# Altium schematic sheet Arriquitaun.SchDoc
size A3
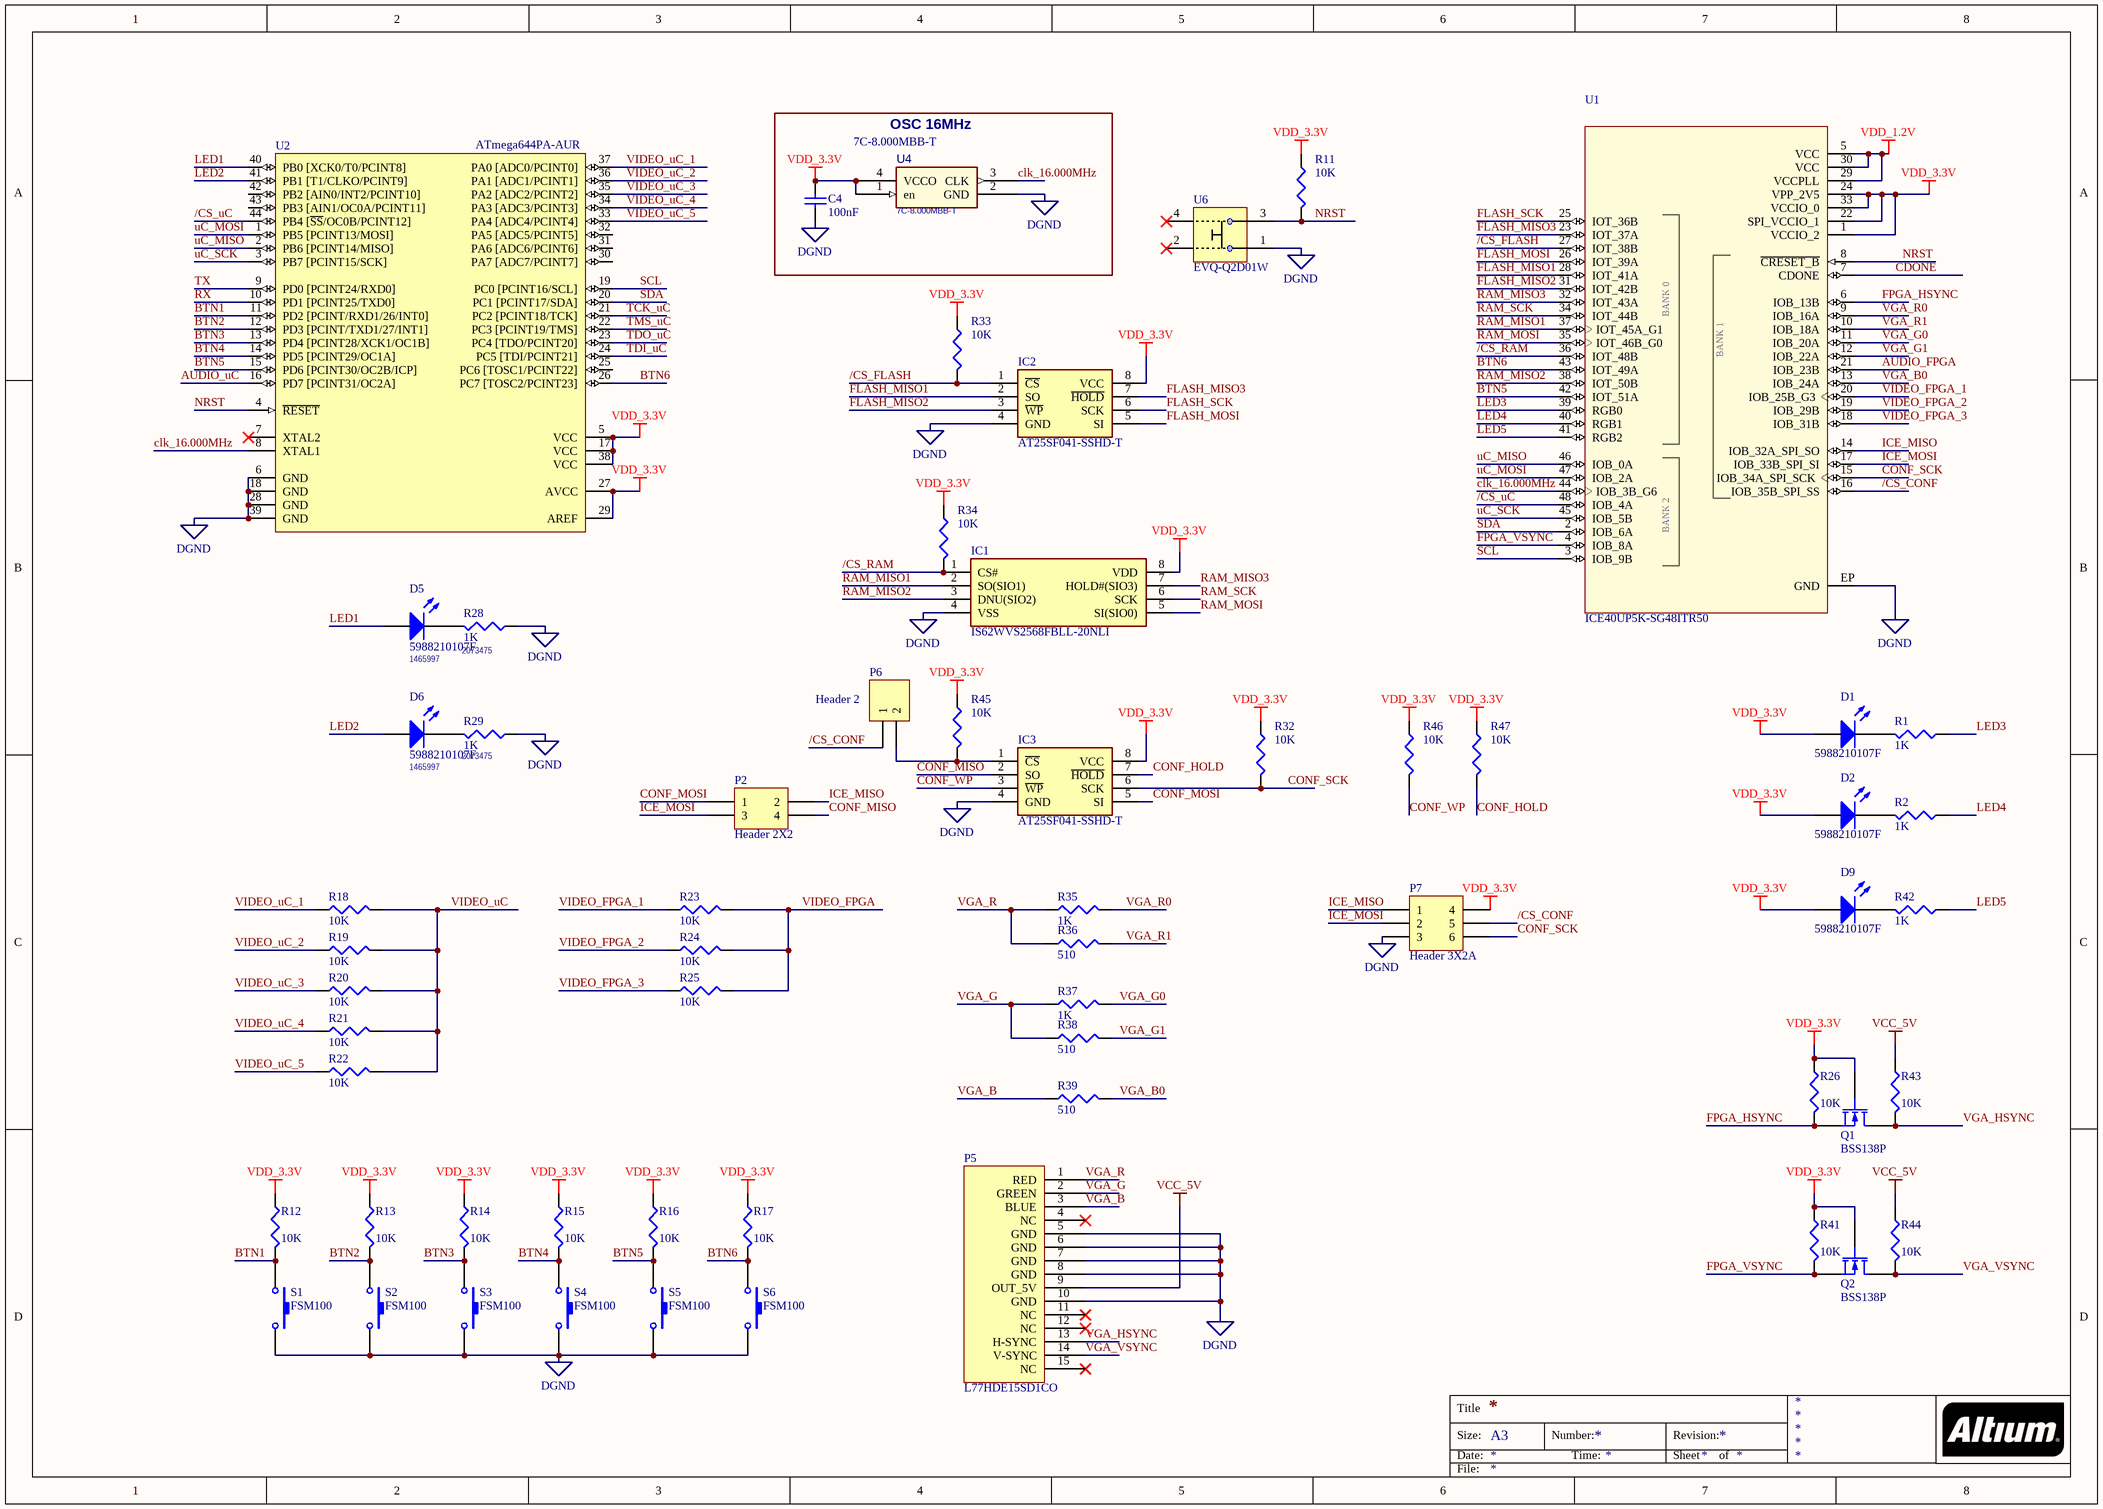
[diagram p0: Arriquitaun.SchDoc]

## Parts
C4  value 100nF  [C1206]  (hidden comment: Cap Semi)
D1  5988210107F  [1206 - LED]
D2  5988210107F  [1206 - LED]
D5  5988210107F  Supplier Part Number 1: 1465997  [1206 - LED]
D6  5988210107F  Supplier Part Number 1: 1465997  [1206 - LED]
D9  5988210107F  [1206 - LED]
IC1  IS62WVS2568FBLL-20NLI  [SOIC127P600X175-8N]
IC2  AT25SF041-SSHD-T  [SOIC127P600X175-8N]
IC3  AT25SF041-SSHD-T  [SOIC127P600X175-8N]
P2  Header 2X2  [HDR2X2]
P5  L77HDE15SD1CO  [DVI-15]
P6  Header 2  [HDR1X2]
P7  Header 3X2A  [HDR2X3_CEN]
Q1  BSS138P  [*SOT23-W]
Q2  BSS138P  [*SOT23-W]
R1  value 1K  [c1206]  (hidden comment: Res3)
R2  value 1K  [c1206]  (hidden comment: Res3)
R11  value 10K  [c1206]  (hidden comment: Res3)
R12  value 10K  [c1206]  (hidden comment: Res3)
R13  value 10K  [c1206]  (hidden comment: Res3)
R14  value 10K  [c1206]  (hidden comment: Res3)
R15  value 10K  [c1206]  (hidden comment: Res3)
R16  value 10K  [c1206]  (hidden comment: Res3)
R17  value 10K  [c1206]  (hidden comment: Res3)
R18  value 10K  [c1206]  (hidden comment: Res3)
R19  value 10K  [c1206]  (hidden comment: Res3)
R20  value 10K  [c1206]  (hidden comment: Res3)
R21  value 10K  [c1206]  (hidden comment: Res3)
R22  value 10K  [c1206]  (hidden comment: Res3)
R23  value 10K  [c1206]  (hidden comment: Res3)
R24  value 10K  [c1206]  (hidden comment: Res3)
R25  value 10K  [c1206]  (hidden comment: Res3)
R26  value 10K  [c1206]  (hidden comment: Res3)
R28  value 1K  Supplier Part Number 1: 2073475  [c1206]  (hidden comment: Res3)
R29  value 1K  Supplier Part Number 1: 2073475  [c1206]  (hidden comment: Res3)
R32  value 10K  [c1206]  (hidden comment: Res3)
R33  value 10K  [c1206]  (hidden comment: Res3)
R34  value 10K  [c1206]  (hidden comment: Res3)
R35  value 1K  [c1206]  (hidden comment: Res3)
R36  value 510  [c1206]  (hidden comment: Res3)
R37  value 1K  [c1206]  (hidden comment: Res3)
R38  value 510  [c1206]  (hidden comment: Res3)
R39  value 510  [c1206]  (hidden comment: Res3)
R41  value 10K  [c1206]  (hidden comment: Res3)
R42  value 1K  [c1206]  (hidden comment: Res3)
R43  value 10K  [c1206]  (hidden comment: Res3)
R44  value 10K  [c1206]  (hidden comment: Res3)
R45  value 10K  [c1206]  (hidden comment: Res3)
R46  value 10K  [c1206]  (hidden comment: Res3)
R47  value 10K  [c1206]  (hidden comment: Res3)
S1  FSM100  [FSM100]
S2  FSM100  [FSM100]
S3  FSM100  [FSM100]
S4  FSM100  [FSM100]
S5  FSM100  [FSM100]
S6  FSM100  [FSM100]
U1  ICE40UP5K-SG48ITR50  [*QFN50P700X700X100-49N_ICE40UP5K-SG48ITR50(Primary)]
U2  ATmega644PA-AUR  [44A_N]
U4  7C-8.000MBB-T  [OSCILADOR]
U6  EVQ-Q2D01W  [PUSHBUTTON]

## Blocks framed on the sheet
OSC 16MHz: C4 U4

## Nets
DGND: C4.1 IC1.4(VSS) IC2.4(GND) IC3.4(GND) P5.5(GND) P5.6(GND) P5.7(GND) P5.8(GND) P5.10(GND) P7.3 R28.1 R29.1 S1.2 S2.2 S3.2 S4.2 S5.2 S6.2 U1.EP(GND) U2.6(GND) U2.18(GND) U2.28(GND) U2.39(GND) U4.2(GND) U6.1
VCC_5V: P5.9(OUT_5V) R43.1 R44.1
VDD_1.2V: U1.5(VCC) U1.29(VCCPLL) U1.30(VCC)
VDD_3.3V: C4.2 D1.1(A) D2.1(A) D9.1(A) IC1.8(VDD) IC2.8(VCC) IC3.8(VCC) P7.4 Q1.1(G) Q2.1(G) R11.1 R12.1 R13.1 R14.1 R15.1 R16.1 R17.1 R26.1 R32.1 R33.1 R34.1 R41.1 R45.1 R46.1 R47.1 U1.1(VCCIO_2) U1.22(SPI_VCCIO_1) U1.24(VPP_2V5) U1.33(VCCIO_0) U2.5(VCC) U2.17(VCC) U2.27(AVCC) U2.29(AREF) U2.38(VCC) U4.1(en) U4.4(VCCO)
/CS_CONF: P6.1 P7.5 U1.16(IOB_35B_SPI_SS)
/CS_FLASH: IC2.1(~{CS}) R33.2 U1.27(IOT_38B)
/CS_RAM: IC1.1(CS#) R34.2 U1.36(IOT_48B)
/CS_uC: U1.48(IOB_4A) U2.44(PB4_[~{SS}/OC0B/PCINT12])
AUDIO_FPGA: U1.21(IOB_23B)
AUDIO_uC: U2.16(PD7_[PCINT31/OC2A])
BTN1: R12.2 S1.1 U2.11(PD2_[PCINT/RXD1/26/INT0])
BTN2: R13.2 S2.1 U2.12(PD3_[PCINT/TXD1/27/INT1])
BTN3: R14.2 S3.1 U2.13(PD4_[PCINT28/XCK1/OC1B])
BTN4: R15.2 S4.1 U2.14(PD5_[PCINT29/OC1A])
BTN5: R16.2 S5.1 U1.42(IOT_51A) U2.15(PD6_[PCINT30/OC2B/ICP])
BTN6: R17.2 S6.1 U1.43(IOT_49A) U2.26(PC7_[TOSC2/PCINT23])
CDONE: U1.7(CDONE)
clk_16.000MHz: U1.44(IOB_3B_G6) U2.8(XTAL1) U4.3(CLK)
CONF_HOLD: IC3.7(~{HOLD}) R47.2
CONF_MISO: IC3.2(SO) P2.4
CONF_MOSI: IC3.5(SI) P2.1
CONF_SCK: IC3.6(SCK) P7.6 R32.2 U1.15(IOB_34A_SPI_SCK)
CONF_WP: IC3.3(~{WP}) R46.2
FLASH_MISO1: IC2.2(SO) U1.28(IOT_41A)
FLASH_MISO2: IC2.3(~{WP}) U1.31(IOT_42B)
FLASH_MISO3: IC2.7(~{HOLD}) U1.23(IOT_37A)
FLASH_MOSI: IC2.5(SI) U1.26(IOT_39A)
FLASH_SCK: IC2.6(SCK) U1.25(IOT_36B)
FPGA_HSYNC: Q1.2(S) R26.2 U1.6(IOB_13B)
FPGA_VSYNC: Q2.2(S) R41.2 U1.4(IOB_8A)
ICE_MISO: P2.2 P7.1 U1.14(IOB_32A_SPI_SO)
ICE_MOSI: P2.3 P7.2 U1.17(IOB_33B_SPI_SI)
LED1: D5.1(A) U2.40(PB0_[XCK0/T0/PCINT8])
LED2: D6.1(A) U2.41(PB1_[T1/CLKO/PCINT9])
LED3: R1.1 U1.39(RGB0)
LED4: R2.1 U1.40(RGB1)
LED5: R42.1 U1.41(RGB2)
NRST: R11.2 U1.8(~{CRESET_B}) U2.4(~{RESET}) U6.3
RAM_MISO1: IC1.2(SO(SIO1)) U1.37(IOT_45A_G1)
RAM_MISO2: IC1.3(DNU(SIO2)) U1.38(IOT_50B)
RAM_MISO3: IC1.7(HOLD#(SIO3)) U1.32(IOT_43A)
RAM_MOSI: IC1.5(SI(SIO0)) U1.35(IOT_46B_G0)
RAM_SCK: IC1.6(SCK) U1.34(IOT_44B)
RX: U2.10(PD1_[PCINT25/TXD0])
SCL: U1.3(IOB_9B) U2.19(PC0_[PCINT16/SCL])
SDA: U1.2(IOB_6A) U2.20(PC1_[PCINT17/SDA])
TCK_uC: U2.21(PC2_[PCINT18/TCK])
TDI_uC: U2.24(PC5_[TDI/PCINT21])
TDO_uC: U2.23(PC4_[TDO/PCINT20])
TMS_uC: U2.22(PC3_[PCINT19/TMS])
TX: U2.9(PD0_[PCINT24/RXD0])
uC_MISO: U1.46(IOB_0A) U2.2(PB6_[PCINT14/MISO])
uC_MOSI: U1.47(IOB_2A) U2.1(PB5_[PCINT13/MOSI])
uC_SCK: U1.45(IOB_5B) U2.3(PB7_[PCINT15/SCK])
VGA_B: P5.3(BLUE) R39.1
VGA_B0: R39.2 U1.13(IOB_24A)
VGA_G: P5.2(GREEN) R37.1 R38.1
VGA_G0: R37.2 U1.11(IOB_20A)
VGA_G1: R38.2 U1.12(IOB_22A)
VGA_HSYNC: P5.13(H-SYNC) Q1.3(D) R43.2
VGA_R: P5.1(RED) R35.1 R36.1
VGA_R0: R35.2 U1.9(IOB_16A)
VGA_R1: R36.2 U1.10(IOB_18A)
VGA_VSYNC: P5.14(V-SYNC) Q2.3(D) R44.2
VIDEO_FPGA: R23.2 R24.2 R25.2
VIDEO_FPGA_1: R23.1 U1.20(IOB_25B_G3)
VIDEO_FPGA_2: R24.1 U1.19(IOB_29B)
VIDEO_FPGA_3: R25.1 U1.18(IOB_31B)
VIDEO_uC: R18.2 R19.2 R20.2 R21.2 R22.2
VIDEO_uC_1: R18.1 U2.37(PA0_[ADC0/PCINT0])
VIDEO_uC_2: R19.1 U2.36(PA1_[ADC1/PCINT1])
VIDEO_uC_3: R20.1 U2.35(PA2_[ADC2/PCINT2])
VIDEO_uC_4: R21.1 U2.34(PA3_[ADC3/PCINT3])
VIDEO_uC_5: R22.1 U2.33(PA4_[ADC4/PCINT4])
NetD1_2: D1.2(K) R1.2
NetD2_2: D2.2(K) R2.2
NetD5_2: D5.2(K) R28.2
NetD6_2: D6.2(K) R29.2
NetD9_2: D9.2(K) R42.2
NetIC3_1: IC3.1(~{CS}) P6.2 R45.2

Not connected (* = marked no-connect by the designer): P5 4(NC)* 11(NC)* 12(NC)* 15(NC)*; U2 7(XTAL2)* 25(PC6_[TOSC1/PCINT22]) 30(PA7_[ADC7/PCINT7]) 31(PA6_[ADC6/PCINT6]) 32(PA5_[ADC5/PCINT5]) 42(PB2_[AIN0/INT2/PCINT10]) 43(PB3_[AIN1/OC0A/PCINT11]); U6 2* 4*

## Notes on the sheet
- Title
- Size:
- Date:
- A3
- Number:
- Time:
- Revision:
- Sheet
- of
- File:
- (in symbol ICE40UP5K-SG48ITR50) BANK 0; BANK 1; BANK 2

## Library data of the parts
C4 = Cap Semi: Capacitor (Semiconductor SIM Model); Published: 8-Jun-2000; LatestRevisionDate: 29-May-2009; LatestRevisionNote: IPC-7351 Footprint Added.; PackageReference: C1206; Publisher: Altium Limited; PackageDescription: Chip Capacitor; Supplier 1: Farnell; Supplier part number 1: 1759123
D1 D2 D5 D6 D9 = 5988210107F: LED, Rojo, Montaje Superficial, 1206 (Métrico 3216), 20 mA, 2 V, 640 nm; Published: 8-Jun-2000; LatestRevisionDate: 17-Jul-2002; LatestRevisionNote: Re-released for DXP Platform.; PackageVersion: Feb-2002; PackageReference: 3.2X1.6X1.1; Publisher: Altium Limited; PackageDescription: SM LED; 2 Flat Leads; Supplier 1: Farnell; ComponentLink1Description: Mouser; ComponentLink1URL: https://eu.mouser.com/ProductDetail/Dialight/598-8210-107F?qs=sGAEpiMZZMseGfSY3csMkcUUSK%2FIVnSgwPTZO%252Bt9HCE%3D; Supplier 2: Mouser; Supplier Part Number 2: 645-598-8210-107F
  D1 D2 D9: Supplier Part Number 1: 1465997
IC1 = IS62WVS2568FBLL-20NLI: SRAM 2Mb 256Kx8 20MHz 2.2-3.6V Serial SRAM; Manufacturer_Name: Integrated Silicon Solution Inc.; Datasheet Link: http://www.issi.com/WW/pdf/IS62-65WVS2568FALL-BLL.pdf; Height: 1.75mm; Manufacturer_Part_Number: IS62WVS2568FBLL-20NLI; Mouser Part Number: 870-WVS2568FBLL20NLI; Mouser Price/Stock: https://www.mouser.com/Search/Refine.aspx?Keyword=870-WVS2568FBLL20NLI; Supplier 1: Mouser; ComponentLink1Description: Mouser; ComponentLink1URL: https://www.mouser.es/ProductDetail/ISSI/IS62WVS2568FBLL-20NLI?qs=sGAEpiMZZMs6Aik9Fp479pkTONfEyU%252BtPqF9anFQNgY%3D; Supplier Part Number 1: 870-WVS2568FBLL20NLI
IC2 IC3 = AT25SF041-SSHD-T: Flash NOR 4Mb, 2.5-3.6V,104Mhz Serial Flash; Manufacturer_Name: Adesto Technologies; Datasheet Link: https://www.adestotech.com/wp-content/uploads/DS-AT25SF041_044.pdf; Height: 1.75mm; Manufacturer_Part_Number: AT25SF041-SSHD-T; Mouser Part Number: 988-AT25SF041-SSHD-T; Mouser Price/Stock: https://www.mouser.com/Search/Refine.aspx?Keyword=988-AT25SF041-SSHD-T; ComponentLink1Description: Mouser; ComponentLink1URL: https://www.mouser.es/ProductDetail/Adesto-Technologies/AT25SF041-SSHD-T?qs=sGAEpiMZZMtI%252BQ06EiAoG2tRW1ubUobjTmCSnL3k0Dw%3D; Supplier 1: Mouser; Supplier 2: Farnell; Supplier Part Number 1: 988-AT25SF041-SSHD-T; Supplier Part Number 2: 2909988
P2 = Header 2X2: Header, 2-Pin, Dual row; LatestRevisionDate: 17-Jul-2002; LatestRevisionNote: Re-released for DXP Platform.; Publisher: Altium Limited
P5 = L77HDE15SD1CO: D-Sub High Density Connectors D SUB; ComponentLink1Description: Mouser; ComponentLink1URL: https://www.mouser.es/ProductDetail/Amphenol-Commercial-Products/L77HDE15SD1CO?qs=sGAEpiMZZMvlX3nhDDO4AIhmb3wSIX3bv9XlW7v%2F%2FAg=; Supplier 1: Mouser
P6 = Header 2: Header, 2-Pin; LatestRevisionDate: 17-Jul-2002; LatestRevisionNote: Re-released for DXP Platform.; Publisher: Altium Limited
P7 = Header 3X2A: Header, 3-Pin, Dual row; LatestRevisionDate: 17-Jul-2002; LatestRevisionNote: Re-released for DXP Platform.; Publisher: Altium Limited
Q1 Q2 = BSS138P: MOSFET N-CH 60 V 360 mA; ComponentLink1Description: Mouser; ComponentLink1URL: https://www.mouser.es/ProductDetail/Nexperia/BSS138P215?qs=sGAEpiMZZMuW3D0gRv32gn9EhwRhF9cb; Supplier 1: Digi-Key; Supplier 2: Farnell; Supplier 3: Mouser; Supplier Part Number 1: 1727-1142-6-ND; Supplier Part Number 2: 1859849RL; Supplier Part Number 3: 771-BSS138P215
R1 R2 R11-R26 R28 R29 R32-R39 R41-R47 = Res3: Resistor; Published: 8-Jun-2000; LatestRevisionDate: 29-May-2009; LatestRevisionNote: IPC-7351 Footprint Added.; PackageReference: J1-0603; Publisher: Altium Limited; PackageDescription: Chip Resistor
  R1 R2 R42: Supplier 1: Farnell; Supplier Part Number 1: 2073475
  R11 R32-R34 R45-R47: Supplier 1: Farnell; Supplier Part Number 1: 2073356
  R28 R29: Supplier 1: Farnell
S1-S6 = FSM100: Interruptores táctiles 12mm FLSH OFF-(ON); Published: 24-Mar-1999; LatestRevisionDate: 17-Jul-2002; LatestRevisionNote: Re-released for DXP Platform.; PackageReference: SPST-2; Publisher: Altium Limited; PackageDescription: Switch; 2 Leads; Supplier 1: Mouser; Supplier Part Number 1: 506-FSM100; Supplier 2: Farnell; Supplier Part Number 2: 1570388
U1 = ICE40UP5K-SG48ITR50: iCE40 UltraPlus 5280 LUTs 39 I/O 1.2 V Surface Mount FOPGA - QFN-48; MF: Lattice Semiconductor; SnapEDA_Link: https://www.snapeda.com/parts/ICE40UP5K-SG48ITR50/Lattice%20Semiconductor%20Corporation/view-part/?ref=snap; Package: QFN-48 Lattice Semiconductor; Availability: Unavailable; Price: None; MP: ICE40UP5K-SG48ITR50; Value: *; Supplier 1: Mouser; Supplier Part Number 1: 842-E40UP5KSG48ITR50; Supplier 2: Digi-Key; Supplier Part Number 2: 220-2145-6-ND; Supplier 3: Mouser
U2 = ATmega644PA-AUR: 8-bit AVR Microcontroller, 64KB Flash, 2KB EEPROM, 4KB SRAM, 44-pin TQFP, Industrial Grade (-40°C to 85°C), Reel; Published: 1-Apr-2010; DatasheetVersion: revA, Jan-2010; PackageVersion: rev.B, Oct-2001; PackageReference: 44A; Publisher: Altium Limited; PackageDescription: 44-Pin Plastic Thin Profile Quad Flat Pack, 10 x 10 x 1.0 mm Body, 0.8 mm Pitch (TQFP); ComponentLink1Description: Manufacturer Link; ComponentLink1URL: http://www.atmel.com/products/avr/default.asp?; ComponentLink2Description: ATmega164A/164PA/324A/324PA/644A/644PA/1284/1284P Datasheet; ComponentLink2URL: http://www.atmel.com/dyn/resources/prod_documents/doc8272.pdf; ComponentLink3Description: ATmega164A/164PA/324A/324PA/644A/644PA/1284/1284P Summary; ComponentLink3URL: http://www.atmel.com/dyn/resources/prod_documents/8272S.pdf; ComponentLink4Description: Atmel.com Home; ComponentLink4URL: http://www.atmel.com; Supplier 1: Mouser; Supplier Part Number 1: 556-ATMEGA644PA-AU; Supplier 2: Farnell; Supplier Part Number 2: 2484915
U4 = 7C-8.000MBB-T: Osciladores de reloj estándar 8 8.000MHz 3.3V50ppm(-10 +70C); Supplier 1: Mouser; Supplier Part Number 1: 717-7C-8.000MBB-T; Supplier 2: Farnell; ComponentLink1Description: Mouser; ComponentLink1URL: https://eu.mouser.com/ProductDetail/TXC-Corporation/7C-8000MBB-T?qs=%2Fha2pyFadugqK0KALn7gcPodYjrkh5fvaJ0tcmnA4H9lIK6XFORkGg%3D%3D; Supplier Part Number 2: 1842054; Supplier 3: Arrow; Supplier Part Number 3: 7C-8.000MBB-T
U6 = EVQ-Q2D01W: Interruptores táctiles Switch Light Touch 6mm Square SMD; Supplier 1: Mouser; Supplier Part Number 1: 667-EVQ-Q2D01W; Supplier 2: Farnell; Supplier Part Number 2: 1821242RL